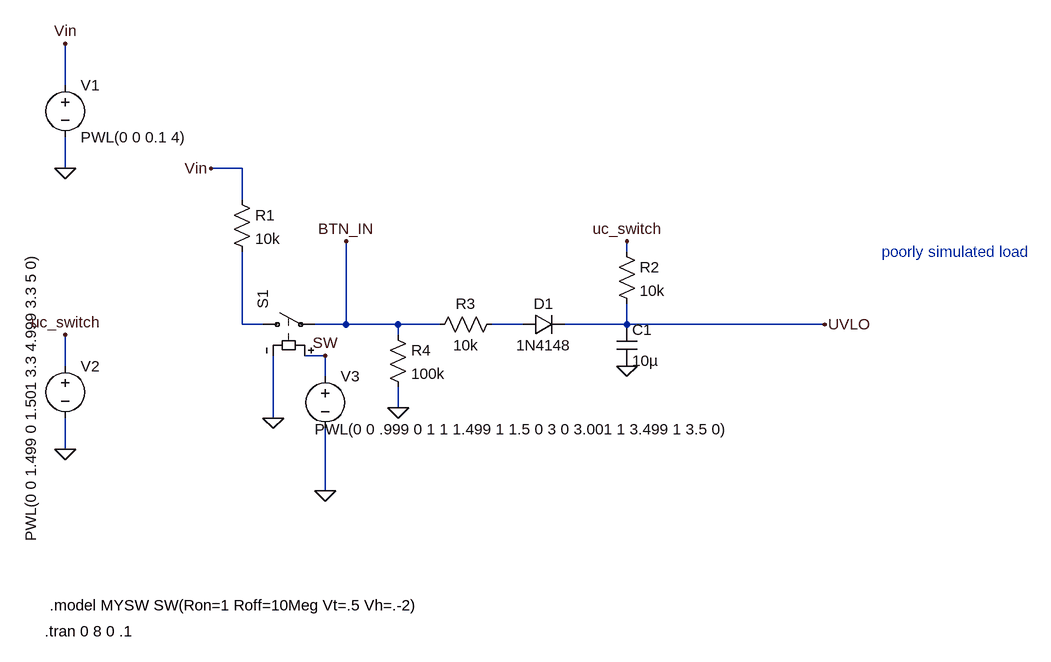
[diagram p0: schematic softpower_4.asc]
softpower_4.asc, the LTspice schematic file:
Version 4
SHEET 1 1092 1176
WIRE -448 -48 -448 -112
WIRE -448 80 -448 32
WIRE -176 80 -224 80
WIRE -176 128 -176 80
WIRE 416 208 416 192
WIRE -176 320 -176 208
WIRE -144 320 -176 320
WIRE -16 320 -16 192
WIRE -16 320 -64 320
WIRE 64 320 -16 320
WIRE 128 320 64 320
WIRE 256 320 208 320
WIRE 416 320 416 288
WIRE 416 320 320 320
WIRE 720 320 416 320
WIRE 64 336 64 320
WIRE -48 368 -80 368
WIRE -448 384 -448 336
WIRE -48 400 -48 368
WIRE 64 448 64 416
WIRE -128 464 -128 368
WIRE -448 512 -448 464
WIRE -48 576 -48 480
FLAG -224 80 Vin
FLAG -448 512 0
FLAG -448 80 0
FLAG -448 -112 Vin
FLAG -448 336 uc_switch
FLAG -48 576 0
FLAG -128 464 0
FLAG 416 192 uc_switch
FLAG 720 320 UVLO
FLAG -16 192 BTN_IN
FLAG 416 384 0
FLAG 64 448 0
FLAG -48 368 SW
SYMBOL sw -160 320 R270
SYMATTR InstName S1
SYMATTR Value ""
SYMATTR SpiceModel MYSW
SYMBOL voltage -448 -64 R0
WINDOW 123 0 0 Left 2
WINDOW 39 0 0 Left 2
SYMATTR InstName V1
SYMATTR Value PWL(0 0 0.1 4)
SYMBOL voltage -448 368 R0
WINDOW 123 0 0 Left 2
WINDOW 39 0 0 Left 2
WINDOW 3 -53 -161 VRight 2
SYMATTR Value PWL(0 0 1.499 0 1.501 3.3 4.999 3.3 5 0)
SYMATTR InstName V2
SYMBOL voltage -48 384 R0
WINDOW 123 0 0 Left 2
WINDOW 39 0 0 Left 2
WINDOW 3 626 97 Right 2
SYMATTR Value PWL(0 0 .999 0 1 1 1.499 1 1.5 0 3 0 3.001 1 3.499 1 3.5 0)
SYMATTR InstName V3
SYMBOL res -192 112 R0
SYMATTR InstName R1
SYMATTR Value 10k
SYMBOL res 400 192 R0
SYMATTR InstName R2
SYMATTR Value 10k
SYMBOL res 224 304 R90
WINDOW 0 0 56 VBottom 2
WINDOW 3 32 56 VTop 2
SYMATTR InstName R3
SYMATTR Value 10k
SYMBOL cap 400 320 R0
SYMATTR InstName C1
SYMATTR Value 10µ
SYMBOL res 48 320 R0
SYMATTR InstName R4
SYMATTR Value 100k
SYMBOL diode 256 336 R270
WINDOW 0 32 32 VTop 2
WINDOW 3 0 32 VBottom 2
SYMATTR InstName D1
SYMATTR Value 1N4148
TEXT 808 208 Left 2 ;poorly simulated load
TEXT -480 792 Left 2 !.tran 0 8 0 .1
TEXT -472 752 Left 2 !.model MYSW SW(Ron=1 Roff=10Meg Vt=.5 Vh=.-2)

The netlist it stands for:
* softpower_4.asc
S1 N001 BTN_IN SW 0 MYSW
V1 Vin 0 PWL(0 0 0.1 4)
V2 uc_switch 0 PWL(0 0 1.499 0 1.501 3.3 4.999 3.3 5 0)
V3 SW 0 PWL(0 0 .999 0 1 1 1.499 1 1.5 0 3 0 3.001 1 3.499 1 3.5 0)
R1 Vin N001 10k
R2 uc_switch UVLO 10k
R3 N002 BTN_IN 10k
C1 UVLO 0 10µ
R4 BTN_IN 0 100k
D1 N002 UVLO 1N4148
.model D D
.lib standard.dio
* poorly simulated load
.tran 0 8 0 .1
.model MYSW SW(Ron=1 Roff=10Meg Vt=.5 Vh=.-2)
.backanno
.end